# EAGLE design Eagle_7Segmentx3 (EAGLE 4.16)
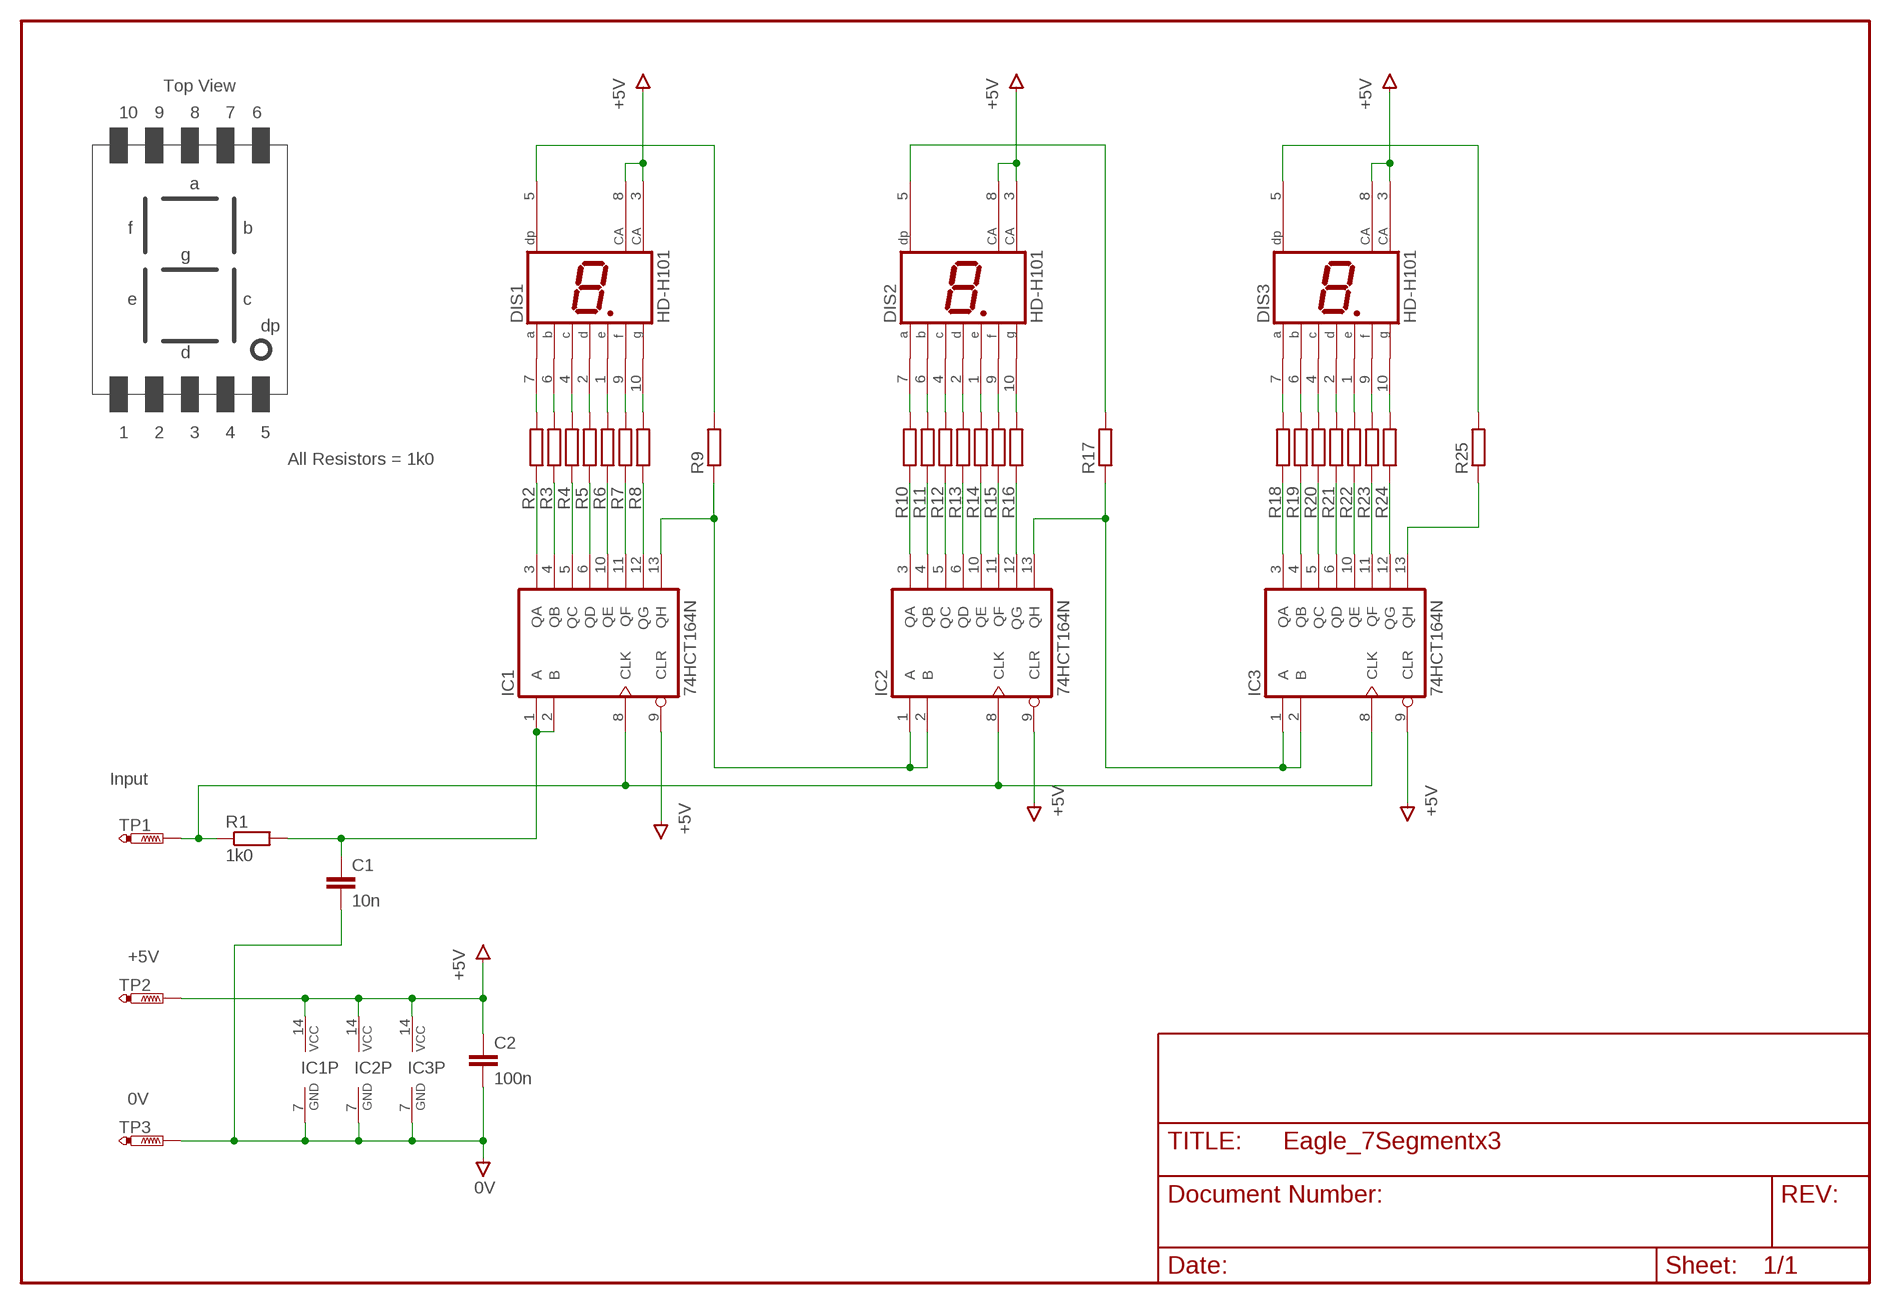
[diagram p0: schematic, sheet 1]

## Parts
C1  10n  C-EU025-024X044  [C025-024X044]
C2  100n  C-EU050-024X044  [C050-024X044]
DIS1  HD-H101  [HDSP-M]
DIS2  HD-H101  [HDSP-M]
DIS3  HD-H101  [HDSP-M]
IC1  74HCT164N  [DIL14]
IC2  74HCT164N  [DIL14]
IC3  74HCT164N  [DIL14]
R1  1k0  R-EU_0207/2V  [0207/2V]
R2  R-EU_0207/2V  [0207/2V]
R3  R-EU_0207/2V  [0207/2V]
R4  R-EU_0207/2V  [0207/2V]
R5  R-EU_0207/2V  [0207/2V]
R6  R-EU_0207/2V  [0207/2V]
R7  R-EU_0207/2V  [0207/2V]
R8  R-EU_0207/2V  [0207/2V]
R9  R-EU_0207/2V  [0207/2V]
R10  R-EU_0207/2V  [0207/2V]
R11  R-EU_0207/2V  [0207/2V]
R12  R-EU_0207/2V  [0207/2V]
R13  R-EU_0207/2V  [0207/2V]
R14  R-EU_0207/2V  [0207/2V]
R15  R-EU_0207/2V  [0207/2V]
R16  R-EU_0207/2V  [0207/2V]
R17  R-EU_0207/2V  [0207/2V]
R18  R-EU_0207/2V  [0207/2V]
R19  R-EU_0207/2V  [0207/2V]
R20  R-EU_0207/2V  [0207/2V]
R21  R-EU_0207/2V  [0207/2V]
R22  R-EU_0207/2V  [0207/2V]
R23  R-EU_0207/2V  [0207/2V]
R24  R-EU_0207/2V  [0207/2V]
R25  R-EU_0207/2V  [0207/2V]
TP1  PTR1PAD1-13  [P1-13]
TP2  PTR1PAD1-13  [P1-13]
TP3  PTR1PAD1-13  [P1-13]

## Nets
0V [PWR]: C1.2 C2.2 IC1.7(GND) IC2.7(GND) IC3.7(GND) TP3.1(TP)
1C2A: IC2.3(QA) R10.1
+5V [PWR]: C2.1 DIS1.3(CA) DIS1.8(CA) DIS2.3(CA) DIS2.8(CA) DIS3.3(CA) DIS3.8(CA) IC1.9(CLR) IC1.14(VCC) IC2.9(CLR) IC2.14(VCC) IC3.9(CLR) IC3.14(VCC) TP2.1(TP)
A1: DIS1.7(A) R2.2
A2: DIS2.7(A) R10.2
B1: DIS1.6(B) R3.2
B2: DIS2.6(B) R11.2
C1: DIS1.4(C) R4.2
C2: DIS2.4(C) R12.2
CLOCK: IC1.8(CLK) IC2.8(CLK) IC3.8(CLK) R1.1 TP1.1(TP)
D1: DIS1.2(D) R5.2
D2: DIS2.2(D) R13.2
DATA1: C1.1 IC1.1(A) IC1.2(B) R1.2
DATA2: IC1.13(QH) IC2.1(A) IC2.2(B) R9.1
DATA3: IC2.13(QH) IC3.1(A) IC3.2(B) R17.1
DP1: DIS1.5(DP) R9.2
DP2: DIS2.5(DP) R17.2
DP3: DIS3.5(DP) R25.2
E1: DIS1.1(E) R6.2
E2: DIS2.1(E) R14.2
F1: DIS1.9(F) R7.2
F2: DIS2.9(F) R15.2
G1: DIS1.10(G) R8.2
G2: DIS2.10(G) R16.2
IC1A: IC1.3(QA) R2.1
IC1B: IC1.4(QB) R3.1
IC1C: IC1.5(QC) R4.1
IC1D: IC1.6(QD) R5.1
IC1E: IC1.10(QE) R6.1
IC1F: IC1.11(QF) R7.1
IC1G: IC1.12(QG) R8.1
IC2B: IC2.4(QB) R11.1
IC2C: IC2.5(QC) R12.1
IC2D: IC2.6(QD) R13.1
IC2E: IC2.10(QE) R14.1
IC2F: IC2.11(QF) R15.1
IC2G: IC2.12(QG) R16.1
IC3A: IC3.3(QA) R18.1
IC3B: IC3.4(QB) R19.1
IC3C: IC3.5(QC) R20.1
IC3D: IC3.6(QD) R21.1
IC3DP: IC3.13(QH) R25.1
IC3E: IC3.10(QE) R22.1
IC3F: IC3.11(QF) R23.1
IC3G: IC3.12(QG) R24.1
N$17: DIS3.7(A) R18.2
N$18: DIS3.6(B) R19.2
N$19: DIS3.4(C) R20.2
N$20: DIS3.2(D) R21.2
N$21: DIS3.1(E) R22.2
N$22: DIS3.9(F) R23.2
N$23: DIS3.10(G) R24.2

## Notes on the sheet
- Top View
- 10 | 9 | 8 | 7 | 6
- a
- f | b
- g
- e | c
- dp
- d
- 1 | 2 | 3 | 4 | 5
- All Resistors = 1k0
- Input
- +5V
- 0V

## Library data of the parts
C1 C2 = rcl:C-EU: CAPACITOR, European symbol
DIS1-DIS3 = display-hp:HD-H101: LED DISPLAY 1-character 7 segment, decimal point right
IC1-IC3 = 74xx-eu:74*164: 8-bit parallel out SHIFT REGISTER
R1-R25 = rcl:R-EU_: RESISTOR, European symbol
TP1-TP3 = testpad:PTR1: TEST PIN

## Net classes
0 default: width 0.254 mm
1 PWR: width 0.508 mm

## Board
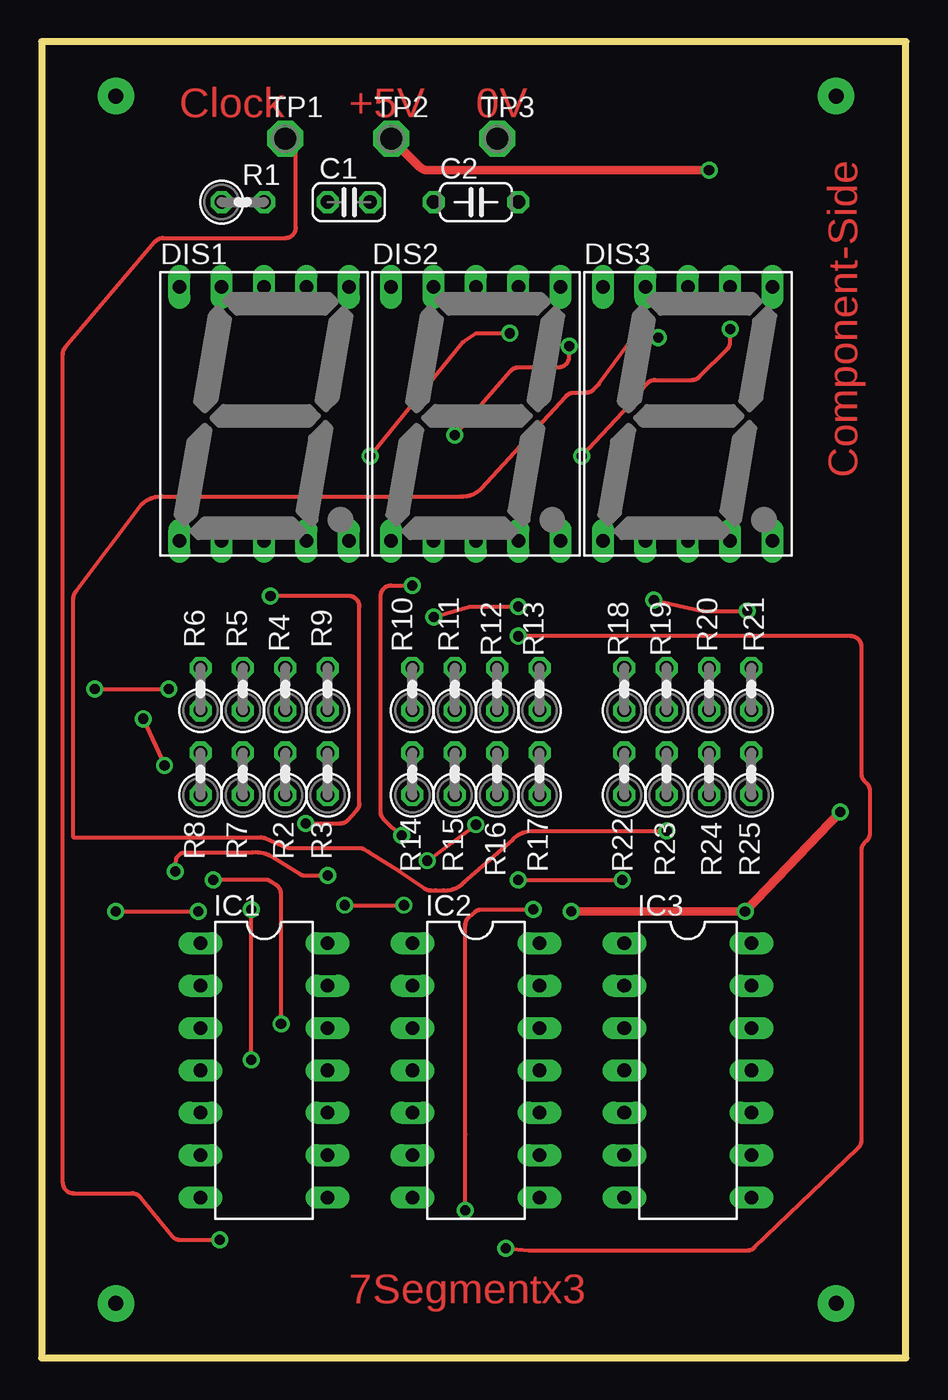
[diagram p1: board, top side]
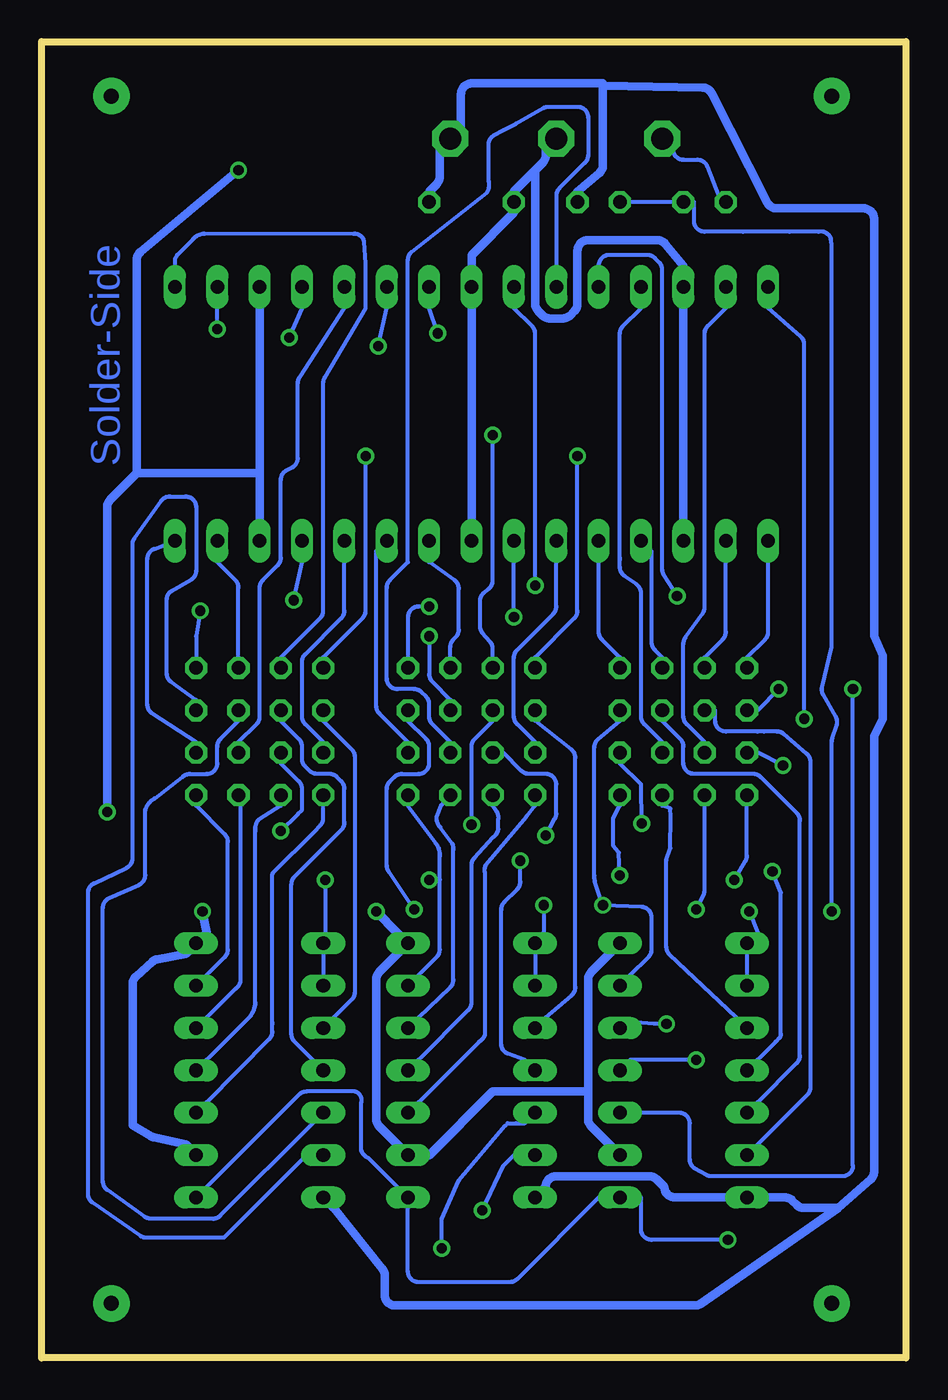
[diagram p2: board, bottom side, seen from below]

Size 51.8 x 78.92 mm. Coordinates in mm from the lower left corner, seen from the top.
Outline: 0,0 51.8,0 51.8,78.92 0,78.92 0,0
Copper layers (1*16): Top 0.035mm / dielectric 1.5mm / Bottom 0.035mm
Design rules "default": minimum track width 10mil, minimum drill 24mil, track to track 8mil, track to pad 10mil, pad to pad 10mil, via to via 10mil, smd to smd 8mil, copper to edge 20mil, drill to drill 8mil, minimum pad ring 10mil, minimum via ring 8mil, stop-mask expansion 4mil, vias tented up to drill 0mil, thermal gap 10mil
tRestrict: area 7,63 to 45.1,65.5; area 7,47.7 to 45.1,50.3; area 8.2,32.5 to 18.4,42.6; area 21,32.5 to 31.1,42.6; area 33.7,32.5 to 43.8,42.6; area 8.2,8.3 to 10.8,26.1; area 15.9,8.3 to 18.4,26.1; area 21,8.3 to 23.5,26.1; area 28.6,8.3 to 31.1,26.1; area 33.7,8.3 to 36.2,26.1; area 41.3,8.3 to 43.8,26.1; area 9.5,68 to 14.6,70.6; 2 more areas

### Footprints (pad centres in the part's own frame; a part is rotated, then mirrored left to right if it is on the bottom)
C025-024X044 = drill 0.813 octagon: 1 -1.27,0; 2 1.27,0
C050-024X044 = drill 0.813 octagon: 1 -2.54,0; 2 2.54,0
HDSP-M = drill 0.813 long: 1 -5.08,-7.62; 2 -2.54,-7.62; 3 0,-7.62; 4 2.54,-7.62; 5 5.08,-7.62; 6 5.08,7.62; 7 2.54,7.62; 8 0,7.62; 9 -2.54,7.62; 10 -5.08,7.62
DIL14 = drill 0.813 long: 1 -7.62,-3.81; 2 -5.08,-3.81; 3 -2.54,-3.81; 4 0,-3.81; 5 2.54,-3.81; 6 5.08,-3.81; 7 7.62,-3.81; 8 7.62,3.81; 9 5.08,3.81; 10 2.54,3.81; 11 0,3.81; 12 -2.54,3.81; 13 -5.08,3.81; 14 -7.62,3.81
0207/2V = drill 0.813 octagon: 1 -1.27,0; 2 1.27,0
P1-13 = drill 1.321 pad 2.159 octagon: 1 0,0

### Placement (x,y rotation side)
C1  18.41,69.3 0 top
C2  26.03,69.3 0 top
DIS1  13.33,56.6 0 top
DIS2  26.03,56.6 0 top
DIS3  38.73,56.6 0 top
IC1  13.33,17.23 270 top
IC2  26.03,17.23 270 top
IC3  38.73,17.23 270 top
R1  12.06,69.3 0 top
R2  14.6,35.01 90 top
R3  17.14,35.01 90 top
R4  14.6,40.09 90 top
R5  12.06,40.09 90 top
R6  9.52,40.09 90 top
R7  12.06,35.01 90 top
R8  9.52,35.01 90 top
R9  17.14,40.09 90 top
R10  22.22,40.09 90 top
R11  24.76,40.09 90 top
R12  27.3,40.09 90 top
R13  29.84,40.09 90 top
R14  22.22,35.01 90 top
R15  24.76,35.01 90 top
R16  27.3,35.01 90 top
R17  29.84,35.01 90 top
R18  34.92,40.09 90 top
R19  37.46,40.09 90 top
R20  40,40.09 90 top
R21  42.54,40.09 90 top
R22  34.92,35.01 90 top
R23  37.46,35.01 90 top
R24  40,35.01 90 top
R25  42.54,35.01 90 top
TP1  14.6,73.11 0 top
TP2  20.95,73.11 0 top
TP3  27.3,73.11 0 top

### Tracks (layer width: path | path; a pad name or v marks a point on that pad's centre or on a via)
0V
  Bottom 0.508: 18.16,76.29 18.16,76.42 26.03,76.42 arc-90 26.66,75.78 26.66,73.75 TP3.1 27.94,72.48 27.94,70.84 arc45 28.12,70.39 28.57,69.94 C2.2 | 18.16,76.29 18.16,71.51 arc50 18.38,71.02 19.68,69.94 C1.2 | IC2.7 21.59,10.25 arc90 20.95,10.88 15.37,10.88 arc45 14.92,10.7 14.47,10.25 arc-90 13.84,9.61 10.79,9.61 IC1.7 8.25,9.61 7.24,9.61 arc45 6.79,9.43 6.53,9.16 arc-45 6.08,8.98 4.06,8.98 | 4.06,8.98 12.28,3.25 arc35 12.64,3.14 30.6,3.14 arc90 31.24,3.77 31.24,4.95 arc-39 31.38,5.34 34.28,8.98 IC3.7 | 18.16,76.29 12.19,76.17 arc62 11.63,75.82 8.3,69.27 arc-63 7.73,68.92 2.53,68.92 arc90 1.9,68.29 1.9,43.27 1.39,42.13 1.39,38.32 1.9,37.3 1.9,11.17 arc49 2.12,10.69 4.06,8.98
1C2A
  Bottom 0.254: IC2.3 21.59,20.41 20.03,21.74 arc-49 19.81,22.22 19.81,35.98 arc-52 20.05,36.47 22.22,38.19 R10.1
+5V  (via drill 0.61)
  Top 0.508: v31.75,26.76 v42.16,26.76 v47.87,32.73 | v40,71.21 23.12,71.21 arc-45 22.67,71.39 21.59,72.48 TP2.1
  Bottom 0.508: DIS1.3 13.33,50.25 13.33,62.95 DIS1.8 13.33,65.49 14.41,66.79 arc-50 14.9,67.02 19.05,67.02 arc-90 19.68,66.38 19.68,63.22 arc45 19.87,62.77 20.13,62.5 arc45 20.58,62.32 21.32,62.32 arc45 21.77,62.5 22.03,62.77 arc45 22.22,63.22 22.22,71.21 | 22.22,71.21 23.49,69.94 C2.1 23.49,68.67 26.03,66.13 26.03,65.49 DIS2.8 26.03,62.95 26.03,50.25 DIS2.3 | 22.22,71.21 21.77,71.66 arc-45 21.59,72.11 21.59,72.48 TP2.1 | 38.73,53.05 38.73,62.95 DIS3.8 | 38.73,53.05 38.73,50.25 DIS3.3 | IC3.9 43.17,12.79 45.05,13.22 arc17 45.23,13.29 46.34,13.93 arc60 46.35,13.94 46.35,22.4 arc48 46.14,22.88 45.18,23.75 arc32 44.87,23.9 43.17,24.22 IC3.14 41.91,25.49 v42.16,26.76 | 19.05,15.96 19.05,14.32 arc-45 18.86,13.87 17.77,12.79 IC1.9 | 19.05,15.96 19.05,22.69 arc45 18.86,23.14 17.77,24.22 IC1.14 | 19.05,15.96 24.76,15.96 28.57,12.15 IC2.9 30.47,12.79 31.56,13.87 arc45 31.75,14.32 31.75,22.69 arc45 31.56,23.14 30.47,24.22 IC2.14 30.47,25.49 v31.75,26.76 | 46.1,53.05 38.73,53.05 | v47.87,32.73 47.87,51.01 arc45 47.69,51.46 46.1,53.05 | 46.1,53.05 46.1,65.83 arc50 45.87,66.32 v40,71.21
A1
  Bottom 0.254: R2.2 14.6,36.92 15.68,38 arc45 15.87,38.45 15.87,45.85 arc-55 16.14,46.37 16.87,46.89 arc55 17.14,47.41 17.14,47.84 17.14,47.98 17.14,61.42 arc45 16.95,61.87 15.87,62.95 DIS1.7
A2  (via drill 0.61)
  Top 0.254: v19.68,54.06 25.27,60.92 26.03,61.43 v28.06,61.43
  Bottom 0.254: v19.68,54.06 19.68,44.8 arc45 19.87,44.35 22.22,42 R10.2 | v28.06,61.43 28.57,62.95 DIS2.7
B1  (via drill 0.61)
  Top 0.254: v13.71,45.68 18.41,45.68 arc-90 19.05,45.05 19.05,33.25 arc-45 18.86,32.8 18.33,32.23 arc-45 17.89,32.04 v15.82,32.04
  Bottom 0.254: v15.82,32.04 15.87,34.38 17.14,35.65 R3.2 | v13.71,45.68 14.5,46.92 arc32 14.6,47.26 14.6,65.23 arc-45 14.79,65.68 15.05,65.94 arc-45 15.5,66.13 17.77,66.13 arc-90 18.41,65.49 DIS1.6
B2  (via drill 0.61)
  Top 0.254: v24.76,55.33 28.13,59.18 arc-49 28.6,59.4 30.98,59.4 arc90 31.62,60.03 v31.62,60.67
  Bottom 0.254: v24.76,55.33 24.76,46.89 24.76,46.83 24.76,46.61 arc50 24.99,46.13 25.29,45.87 arc-50 25.52,45.39 25.52,43.88 arc-40 25.37,43.47 24.91,42.92 arc40 24.76,42.51 24.76,42 R11.2 | v31.62,60.67 31.11,62.95 DIS2.6
C1
  Bottom 0.254: R4.2 14.6,42 15.05,42.45 arc45 15.23,42.9 15.23,48.35 DIS1.4
C2
  Bottom 0.254: R12.2 27.3,42 27.3,42.62 arc45 27.11,43.07 26.98,43.21 arc-45 26.79,43.66 26.79,46.12 arc-54 27.06,46.63 28.57,47.71 DIS2.4
CLOCK  (via drill 0.61)
  Top 0.254: v10.66,7.07 8.3,7.07 arc-51 7.81,7.31 5.9,9.64 arc51 5.41,9.87 1.9,9.87 arc-90 1.27,10.5 1.27,60.18 arc-40 1.42,60.59 6.79,66.92 arc-50 7.27,67.14 14.6,67.14 arc90 15.23,67.78 15.23,72.48 TP1.1
  Bottom 0.254: R1.1 arc69 11.19,69.58 11.9,71.44 arc-69 12.5,71.84 13.33,71.84 arc90 13.96,72.48 TP1.1 | IC3.8 41.91,10.25 36.38,15.78 arc45 35.93,15.96 33.02,15.96 arc90 32.63,15.33 32.63,12.42 arc-45 32.19,11.97 30.47,10.25 IC2.8 29.84,8.98 29.84,5.17 arc-90 29.2,4.53 23.75,4.53 arc-45 23.3,4.72 18.41,9.61 IC1.8 15.87,9.61 15.87,7.71 arc-90 15.23,7.07 v10.66,7.07
D1
  Bottom 0.254: R5.2 12.06,42 10.98,43.08 arc-45 10.79,43.53 10.79,47.71 DIS1.2
D2  (via drill 0.61)
  Top 0.254: v23.49,44.41 25.65,45.05 v28.57,45.05
  Bottom 0.254: v23.49,44.41 23.49,47.71 DIS2.2 | v28.57,45.05 29.2,45.05 arc-90 29.84,44.41 29.84,42 R13.2
DATA1  (via drill 0.61)
  Top 0.254: v9.39,26.76 5.96,26.76 v4.44,26.76
  Bottom 0.254: IC1.2 9.52,22.95 9.52,24.22 IC1.1 8.88,25.49 v9.39,26.76 | C1.1 16.5,69.3 13.96,69.3 R1.2 12.7,69.3 12.7,68.16 arc-90 12.06,67.53 9.77,67.53 6.98,67.53 5.24,67.53 arc82 4.49,67.11 4.44,66.76 4.44,42.63 5.02,40.21 arc-43 4.95,39.75 4.2,38.44 arc48 4.15,37.92 4.41,37.14 arc-18 4.44,36.94 4.44,30.95 v4.44,26.76
DATA2  (via drill 0.61)
  Top 0.254: v18.16,27.14 v21.71,27.14
  Bottom 0.254: IC2.2 22.22,22.95 22.22,24.22 IC2.1 21.71,25.49 v21.71,27.14 | IC1.13 16.5,22.95 15.42,24.03 arc-45 15.23,24.48 15.23,26.4 arc-88 15.84,27.04 v18.16,27.14 18.63,28.57 arc18 18.66,28.77 18.66,28.92 18.66,36.62 arc50 18.44,37.11 17.14,38.19 R9.1
DATA3  (via drill 0.61)
  Top 0.254: v28.57,28.66 v34.79,28.66
  Bottom 0.254: IC3.2 34.92,22.95 34.92,24.22 IC3.1 34.79,25.49 v34.79,28.66 | 27.94,28.66 27.94,24.48 arc45 28.12,24.03 29.2,22.95 IC2.13 | 27.94,28.66 27.94,30.08 arc-45 28.19,30.87 29.84,33.11 R17.1 | 27.94,28.66 v28.57,28.66
DP1
  Bottom 0.254: R9.2 17.14,42 18.22,43.08 arc45 18.41,43.53 18.41,47.71 DIS1.5
DP2
  Bottom 0.254: R17.2 29.84,36.92 31.56,38.64 arc45 31.75,39.09 31.75,48.35 DIS2.5
DP3
  Bottom 0.254: R25.2 42.54,36.92 45.17,38.64 arc57 45.46,39.17 45.46,47.91 arc69 45.05,48.51 DIS3.5
E1
  Bottom 0.254: R6.2 9.52,42 8.44,43.08 arc-45 8.25,43.53 8.25,47.71 DIS1.1
E2
  Bottom 0.254: R14.2 22.22,36.92 23.3,38 arc45 23.49,38.45 23.49,41.99 arc45 23.3,42.44 21.14,44.61 arc-45 20.95,45.06 20.95,47.71 DIS2.1
F1
  Bottom 0.254: R7.2 12.06,36.92 13.14,38 arc45 13.33,38.45 13.33,42.81 arc36 13.21,43.18 12.18,44.63 arc-36 12.06,45 12.06,61.42 arc45 11.87,61.87 10.79,62.95 DIS1.9
F2  (via drill 0.61)
  Top 0.254: v21.59,31.33 20.95,31.84 20.5,32.29 arc-45 20.31,32.74 20.31,45.68 arc-90 20.95,46.32 v22.22,46.32
  Bottom 0.254: v21.59,31.33 21.03,32.33 arc-29 20.95,32.64 20.95,34.38 arc-90 21.59,35.01 22.59,35.01 arc45 23.04,35.2 24.12,36.28 R15.2 | v22.22,46.32 22.22,61.42 arc-45 22.41,61.87 23.49,62.95 DIS2.9
G1  (via drill 0.61)
  Top 0.254: v6.09,38.32 v7.36,35.52
  Bottom 0.254: v7.36,35.52 8.88,36.28 R8.2 | v6.09,38.32 6.09,38.82 6.09,60.76 arc-49 6.31,61.24 8.25,62.95 DIS1.10
G2
  Bottom 0.254: R16.2 27.3,36.92 28.38,38 arc45 28.57,38.45 28.57,39.2 arc-45 28.76,39.64 29.02,39.91 arc-45 29.47,40.09 30.47,40.09 arc90 31.11,40.73 31.11,46.18 arc45 30.92,46.63 29.84,47.71 29.84,65.84 arc49 29.62,66.32 25.11,69.88 arc-49 25.01,70.61 25.01,72.74 arc60 24.69,73.3 24.12,73.62 23.36,74 21.73,74.94 arc30 21.42,75.02 19.68,75.02 arc90 19.05,74.38 19.05,72.11 arc45 19.23,71.66 20.76,70.12 arc-45 20.95,69.68 20.95,65.49 DIS2.10
IC1A
  Bottom 0.254: IC1.3 10.16,20.41 14.15,24.16 arc47 14.35,24.62 14.36,29.85 14.12,30.56 14.1,32.47 14.12,32.93 14.6,33.11 R2.1
IC1B  (via drill 0.61)
  Top 0.254: v8,29.17 8.06,29.92 arc-54 8.58,30.32 12.64,30.32 arc-32 13.74,30.09 15.46,29.01 arc32 15.67,28.92 v17.14,28.92
  Bottom 0.254: v8,29.17 7.49,27.9 7.49,19.4 arc45 7.58,19.17 7.8,18.95 8.88,17.87 IC1.4 | v17.14,28.92 17.2,30.3 17.53,30.68 17.53,32.37 17.14,33.11 R3.1
IC1C
  Bottom 0.254: IC1.5 8.88,15.33 6.53,17.68 arc-45 6.34,18.13 6.34,32.21 arc-45 6.53,32.66 8.7,34.83 arc-45 9.15,35.01 12.7,35.01 arc90 13.33,35.65 13.33,36.66 arc-45 13.52,37.11 14.6,38.19 R4.1
IC1D
  Bottom 0.254: IC1.6 8.88,12.79 5.9,15.78 arc-45 5.71,16.23 5.71,34.38 5.71,35.01 5.71,35.74 arc-49 5.93,36.22 7.31,37.4 arc-41 7.72,37.55 8.5,37.55 8.88,37.55 10.79,37.55 arc90 11.42,38.19 11.42,38.82 R5.1
IC1E  (via drill 0.61)
  Top 0.254: v3.17,40.09 v7.62,40.09
  Bottom 0.254: v3.17,40.09 3.17,11.52 arc90 3.8,10.88 11.64,10.88 arc29 11.95,10.96 12.62,11.34 arc61 12.95,11.89 12.95,14.06 arc-90 13.58,14.69 15.87,14.69 IC1.10 | v7.62,40.09 8.88,38.82 R6.1
IC1F  (via drill 0.61)
  Top 0.254: v12.57,17.87 v12.57,26.89
  Bottom 0.254: v12.57,17.87 16.5,17.87 IC1.11 | v12.57,26.89 12.13,27.77 arc-27 12.06,28.05 12.06,33.11 R7.1
IC1G  (via drill 0.61)
  Top 0.254: v14.35,20.03 14.35,27.39 14.35,27.82 arc56 14.06,28.34 13.74,28.56 arc34 13.39,28.66 v10.28,28.66
  Bottom 0.254: v14.35,20.03 15.11,20.03 16.5,20.16 IC1.12 | v10.28,28.66 9.61,29.78 arc-31 9.52,30.11 9.52,33.11 R8.1
IC2B  (via drill 0.61)
  Top 0.254: v23.11,29.81 v26.03,31.97
  Bottom 0.254: v23.11,29.81 23.11,28.55 arc45 23.3,28.1 24.06,27.33 arc-46 24.25,26.87 24.25,18.81 arc-69 23.83,18.23 22.86,17.87 IC2.4 | v26.03,31.97 26.03,36.66 arc45 25.84,37.11 24.76,38.19 R11.1
IC2C  (via drill 0.61)
  Top 0.254: v27.81,6.57 29.2,6.44 42.28,6.44 arc44 42.72,6.62 48.95,12.6 arc46 49.14,13.06 49.14,30.43 arc-45 49.33,30.88 49.47,31.02 arc45 49.65,31.47 49.65,33.99 arc45 49.47,34.44 49.33,34.57 arc-45 49.14,35.02 49.14,42.63 arc90 48.51,43.27 v28.57,43.27
  Bottom 0.254: v27.81,6.57 27.81,8.34 26.79,10.63 24,13.93 23.87,14.06 23.36,14.06 22.86,14.06 IC2.5 | v28.57,43.27 28.57,40.99 arc-45 28.38,40.54 27.3,39.46 R12.1
IC2D  (via drill 0.61)
  Top 0.254: v25.39,8.85 25.39,13.42 25.39,25.95 arc-50 25.62,26.44 25.98,26.74 arc-40 26.39,26.89 29.33,26.89 v29.46,26.89
  Bottom 0.254: v25.39,8.85 24.12,11.52 23.49,12.15 IC2.6 | v29.46,26.89 30.97,29.13 arc38 31.11,29.52 31.11,34.12 arc45 30.92,34.56 30.66,34.83 arc45 30.21,35.01 29.2,35.01 arc-90 28.57,35.65 28.57,36.66 arc-45 28.76,37.11 29.84,38.19 R13.1
IC2E
  Bottom 0.254: IC2.10 29.2,15.33 25.58,18.95 arc-45 25.22,19.4 25.22,29.07 arc40 25.18,29.54 22.73,32.47 22.22,33.11 R14.1
IC2F
  Bottom 0.254: IC2.11 29.2,17.87 26.22,20.86 arc-45 26.03,21.31 26.03,29.54 arc45 25.86,29.97 24.73,31.22 arc-45 24.42,31.71 24.42,32.32 arc-40 24.52,32.74 24.76,33.11 R15.1
IC2G
  Bottom 0.254: IC2.12 29.2,20.41 27.32,22.2 arc-46 27.12,22.66 27.12,30.46 arc-23 27.17,30.83 27.91,31.81 arc45 28.13,32.44 27.86,33.12 R16.1
IC3A
  Bottom 0.254: IC3.3 34.28,20.41 33.2,21.49 arc-45 33.02,21.94 33.02,36.02 arc-45 33.2,36.47 34.92,38.19 R18.1
IC3B
  Bottom 0.254: IC3.4 35.55,17.87 36.64,18.95 arc45 36.83,19.4 36.83,28.4 arc45 36.64,28.85 33.84,31.65 arc-45 33.65,32.1 33.65,34.12 arc-45 33.84,34.56 34.1,34.83 arc-45 34.55,35.01 35.29,35.01 arc45 35.74,35.2 36,35.46 arc45 36.19,35.91 36.19,36.66 arc-45 36.38,37.11 37.46,38.19 R19.1
IC3C
  Bottom 0.254: IC3.5 35.55,14.06 41.08,8.53 arc45 41.53,8.34 45.26,8.34 arc36 45.63,8.46 47.86,10.06 arc54 48.13,10.58 48.13,26.98 arc66 47.75,27.56 45.96,28.37 arc-66 45.59,28.95 45.59,32.85 arc45 45.02,33.55 43.36,34.83 arc45 42.91,35.01 41.91,35.01 arc-90 41.27,35.65 41.27,36.66 arc45 41.08,37.11 40,38.19 R20.1
IC3D
  Bottom 0.254: IC3.6 36.19,11.9 40.45,7.64 40.88,7.21 arc45 40.9,7.2 45.52,7.2 arc35 45.88,7.31 48.74,9.3 arc55 49.02,9.82 49.02,27.88 arc65 48.66,28.46 46.71,29.38 arc-65 46.35,29.95 46.35,48.78 arc36 46.23,49.15 44.64,51.39 arc54 44.12,51.65 43.17,51.65 arc90 42.54,51.02 42.54,47.19 arc60 42.86,46.64 44,45.99 arc-60 44.32,45.44 44.32,41.06 arc-54 44.05,40.54 42.54,39.46 R21.1
IC3DP
  Bottom 0.254: IC3.13 41.91,22.95 40.82,24.03 arc-45 40.64,24.48 40.64,30.94 arc-45 40.82,31.39 42.54,33.11 R25.1
IC3E
  Bottom 0.254: IC3.10 41.91,15.33 38.15,19.12 arc-45 37.97,19.57 37.97,20 37.97,20.04 37.97,20.1 37.97,28.99 arc45 37.94,29.07 35.43,31.57 35.09,31.94 arc-43 34.92,32.37 34.92,32.5 34.92,33.16 R22.1
IC3F
  Bottom 0.254: IC3.11 41.91,17.87 39.42,20.35 arc-45 38.98,21.31 38.98,31.58 arc45 38.8,32.28 37.46,33.11 R23.1
IC3G
  Bottom 0.254: IC3.12 41.91,20.41 40.19,22.13 arc-45 39.87,22.58 39.87,33.11 R24.1
N$1  (via drill 0.9 pad 2.18)
  other vias: 4.44,75.65
N$2  (via drill 0.9 pad 2.18)
  other vias: 47.62,75.65
N$3  (via drill 0.9 pad 2.18)
  other vias: 4.44,3.26
N$5  (via drill 0.9 pad 2.18)
  other vias: 47.62,3.26
N$17  (via drill 0.61)
  Top 0.254: v32.38,54.06 35.68,57.62 36.25,58.38 arc-53 36.76,58.64 38.97,58.64 arc45 39.42,58.82 41.08,60.48 arc45 41.27,60.93 v41.27,61.68
  Bottom 0.254: v32.38,54.06 32.38,44.8 arc45 32.57,44.35 34.92,42 R18.2 | v41.27,61.68 41.27,62.95 DIS3.7
N$18
  Bottom 0.254: R19.2 37.46,42 35.11,44.35 arc-45 34.92,44.8 34.92,58.46 arc30 34.83,58.78 32.38,62.95 32.38,65.62 32.47,66.93 arc-87 33.11,67.39 42.03,67.4 arc-45 42.72,67.09 43.68,66.13 43.81,65.88 43.81,65.49 DIS3.6
N$19
  Bottom 0.254: R20.2 40,42 40,46.18 arc-45 40.19,46.63 41.27,47.71 DIS3.4
N$20  (via drill 0.61)
  Top 0.254: v36.7,45.43 39.62,44.79 v42.29,44.79
  Bottom 0.254: v36.7,45.43 36.19,47.71 DIS3.2 | v42.29,44.79 42.54,43.27 42.54,42 R21.2
N$21
  Bottom 0.254: R22.2 34.92,36.92 36,38 arc45 36.19,38.45 36.19,41.74 arc45 36,42.19 33.84,44.35 arc-45 33.65,44.8 33.65,47.71 DIS3.1
N$22  (via drill 0.61)
  Top 0.254: v36.95,61.18 35.75,61.18 arc54 35.24,60.91 33.4,58.38 33.07,58.06 arc-45 32.62,57.87 31.9,57.87 arc48 31.43,57.66 26.35,52.12 arc-48 25.11,51.65 7.24,51.65 arc45 6.03,51.21 2.09,46 arc45 1.9,45.55 1.9,31.2 13.16,31.2 arc-24 13.41,31.15 14.6,30.62 arc24 14.86,30.57 19.01,30.57 arc-29 19.31,30.49 19.58,30.35 21.46,29.17 22.95,28.14 arc35 23.31,28.03 23.62,28.03 24.07,28.03 arc51 25.33,28.52 28.25,31.09 arc-51 29.51,31.58 v37.46,31.58
  Bottom 0.254: v36.95,61.18 36.19,62.95 DIS3.9 | v37.46,31.58 36.44,32.59 arc45 36.44,32.61 36.19,32.86 36.19,34.12 arc-45 36.38,34.56 37.46,35.65 R23.2
N$23
  Bottom 0.254: R24.2 40,36.92 38.92,38 arc-45 38.73,38.45 38.73,46.18 arc45 38.54,46.63 37.65,47.53 arc-45 37.46,47.98 37.46,52.66 arc63 37.11,53.22 36.8,53.38 arc-63 36.44,53.95 36.44,58.45 arc33 36.34,58.79 33.65,62.95 DIS3.10

### Text on the board
Top: Clock | +5V | 0V | Component-Side | 7Segmentx3
Bottom: Solder-Side
Document: Mount TP1,2,3 on Solder-Side | Keep Distance from DIS1,2,3 to Board as far as possible